# EAGLE design Finishline Display (EAGLE 7.7.0)
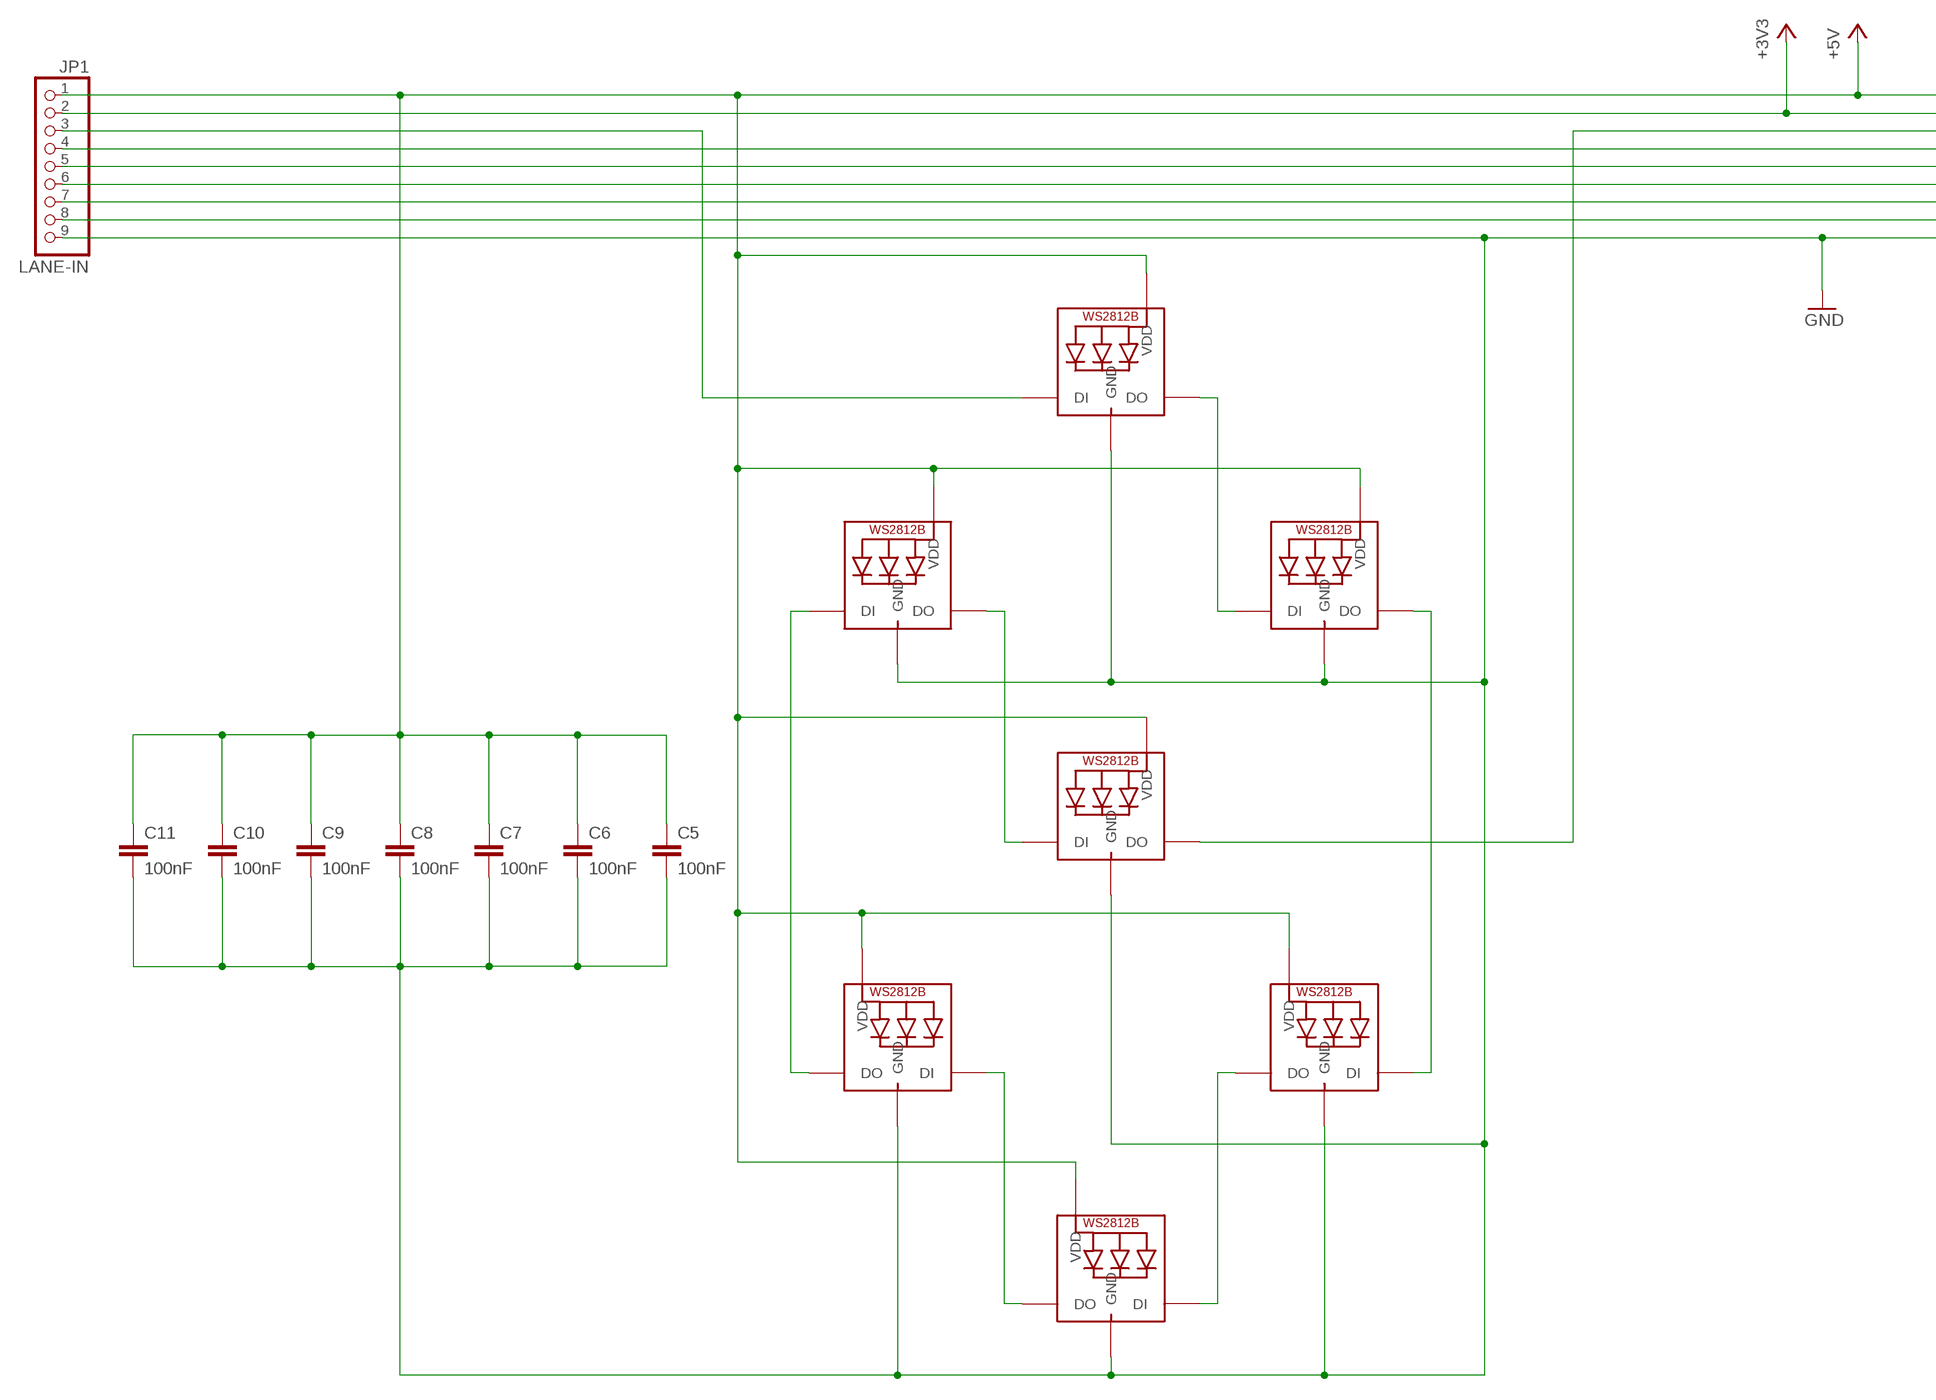
[diagram p0: schematic, sheet 1, part 1 of 2]
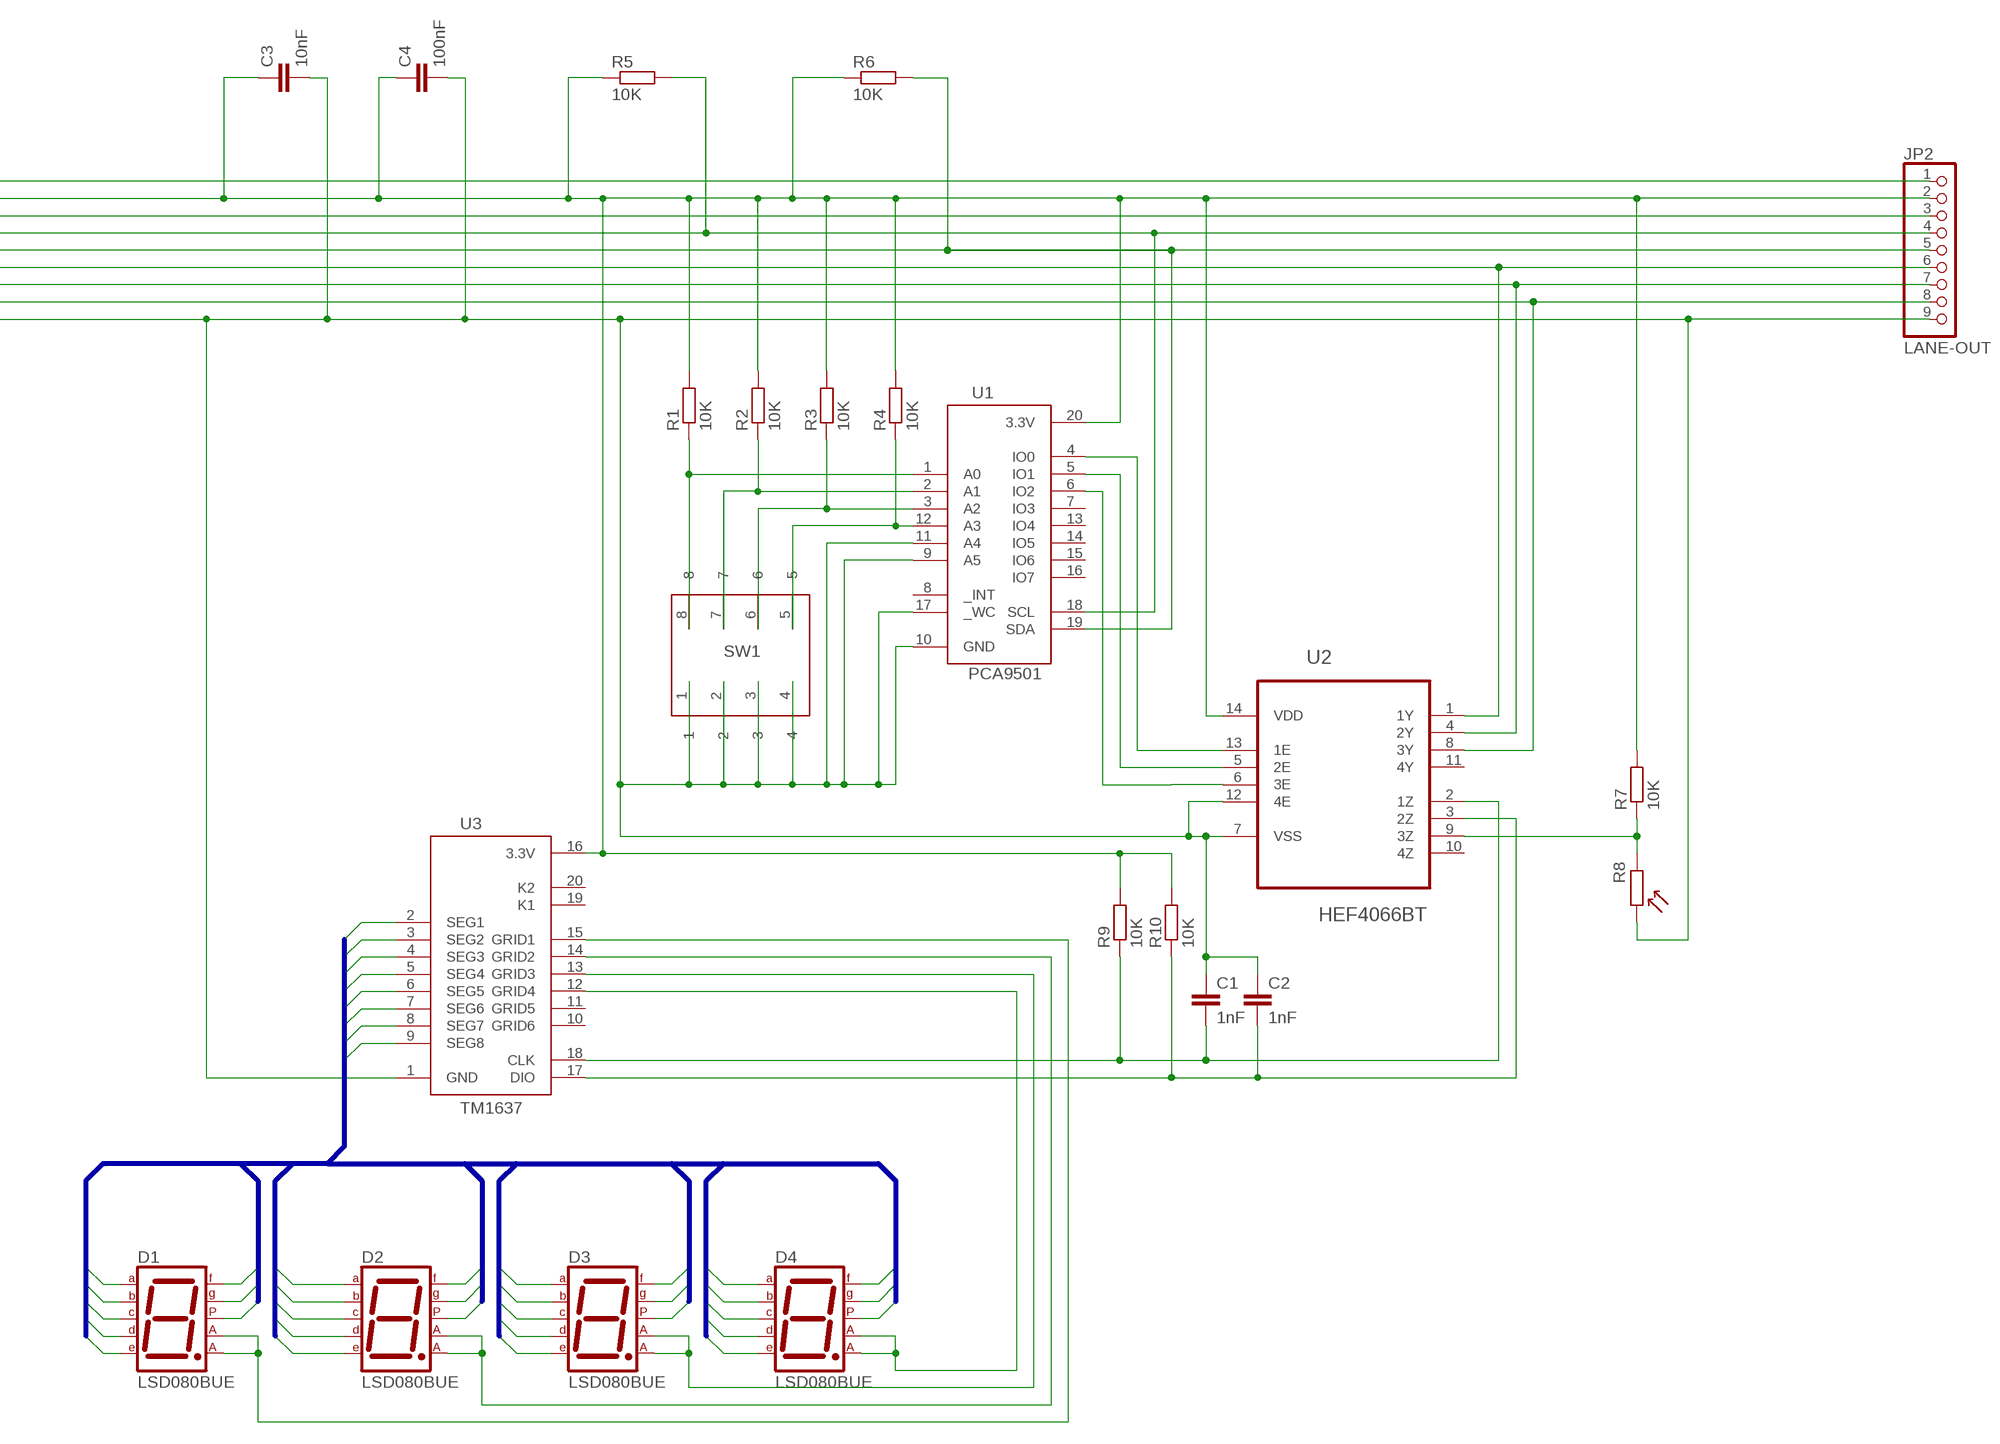
[diagram p1: schematic, sheet 1, part 2 of 2]

## Parts
C1  1nF  C-EUC0805  [C0805]
C2  1nF  C-EUC0805  [C0805]
C3  10nF  C-EUC0805  [C0805]
C4  100nF  C-EUC0805  [C0805]
C5  100nF  C-EUC0805  [C0805]
C6  100nF  C-EUC0805  [C0805]
C7  100nF  C-EUC0805  [C0805]
C8  100nF  C-EUC0805  [C0805]
C9  100nF  C-EUC0805  [C0805]
C10  100nF  C-EUC0805  [C0805]
C11  100nF  C-EUC0805  [C0805]
D1  LSD080BUE  7SEG-CA  [7SEG-13]
D2  LSD080BUE  7SEG-CA  [7SEG-13]
D3  LSD080BUE  7SEG-CA  [7SEG-13]
D4  LSD080BUE  7SEG-CA  [7SEG-13]
JP1  LANE-IN  PINHD-1X9  [1X09]
JP2  LANE-OUT  PINHD-1X9  [1X09]
LED1  WS2812B5050  [WS2812B]
LED2  WS2812B5050  [WS2812B]
LED3  WS2812B5050  [WS2812B]
LED4  WS2812B5050  [WS2812B]
LED5  WS2812B5050  [WS2812B]
LED6  WS2812B5050  [WS2812B]
LED7  WS2812B5050  [WS2812B]
R1  10K  R-EU_M0805  [M0805]
R2  10K  R-EU_M0805  [M0805]
R3  10K  R-EU_M0805  [M0805]
R4  10K  R-EU_M0805  [M0805]
R5  10K  R-EU_M0805  [M0805]
R6  10K  R-EU_M0805  [M0805]
R7  10K  R-EU_M0805  [M0805]
R8  LDR 10K  LDR-TH  [1X02]
R9  10K  R-EU_M0805  [M0805]
R10  10K  R-EU_M0805  [M0805]
SW1  416131160804  [416131160804]
U1  PCA9501  [SOIC127P1032X265-20N]
U2  HEF4066BT  [SOIC127P600X175-14N]
U3  TM1637  [SOIC127P1032X265-20N]

## Nets
+3V3: C3.1 C4.1 JP1.2 JP2.2 R1.2 R2.2 R3.2 R4.2 R5.1 R6.1 R7.2 R9.2 R10.2 U1.20(3.3V) U2.14(VDD) U3.16(3.3V)
+5V: C5.1 C6.1 C7.1 C8.1 C9.1 C10.1 C11.1 JP1.1 JP2.1 LED1.1-VDD(VDD) LED2.1-VDD(VDD) LED3.1-VDD(VDD) LED4.1-VDD(VDD) LED5.1-VDD(VDD) LED6.1-VDD(VDD) LED7.1-VDD(VDD)
CLK: JP1.6 JP2.6 U2.1(1Y)
DIO: JP1.7 JP2.7 U2.4(2Y)
GND: C1.1 C2.1 C3.2 C4.2 C5.2 C6.2 C7.2 C8.2 C9.2 C10.2 C11.2 JP1.9 JP2.9 LED1.3-GND(GND) LED2.3-GND(GND) LED3.3-GND(GND) LED4.3-GND(GND) LED5.3-GND(GND) LED6.3-GND(GND) LED7.3-GND(GND) R8.2 SW1.1 SW1.2 SW1.3 SW1.4 U1.9(A5) U1.10(GND) U1.11(A4) U1.17(_WC) U2.7(VSS) U2.12(4E) U3.1(GND)
LDR: JP1.8 JP2.8 U2.8(3Y)
N$1: U1.4(IO0) U2.13(1E)
N$2: LED1.2-DOUT(DO) LED2.4-DIN(DI)
N$3: LED2.2-DOUT(DO) LED3.4-DIN(DI)
N$4: LED3.2-DOUT(DO) LED4.4-DIN(DI)
N$5: LED4.2-DOUT(DO) LED5.4-DIN(DI)
N$6: LED5.2-DOUT(DO) LED6.4-DIN(DI)
N$7: LED6.2-DOUT(DO) LED7.4-DIN(DI)
N$8: JP2.3 LED7.2-DOUT(DO)
N$9: D1.3(CA1) D1.8(CA2) U3.15(GRID1)
N$10: D2.3(CA1) D2.8(CA2) U3.14(GRID2)
N$11: D3.3(CA1) D3.8(CA2) U3.13(GRID3)
N$12: D4.3(CA1) D4.8(CA2) U3.12(GRID4)
N$13: U1.5(IO1) U2.5(2E)
N$14: R1.1 SW1.8 U1.1(A0)
N$15: R2.1 SW1.7 U1.2(A1)
N$16: R3.1 SW1.6 U1.3(A2)
N$17: R4.1 SW1.5 U1.12(A3)
N$18: C1.2 R9.1 U2.2(1Z) U3.18(CLK)
N$19: C2.2 R10.1 U2.3(2Z) U3.17(DIO)
N$20: R7.1 R8.1 U2.9(3Z)
N$21: U1.6(IO2) U2.6(3E)
SCL: JP1.4 JP2.4 R5.2 U1.18(SCL)
SDA: JP1.5 JP2.5 R6.2 U1.19(SDA)
SEG1: D1.7(A) D2.7(A) D3.7(A) D4.7(A) U3.2(SEG1)
SEG2: D1.6(B) D2.6(B) D3.6(B) D4.6(B) U3.3(SEG2)
SEG3: D1.4(C) D2.4(C) D3.4(C) D4.4(C) U3.4(SEG3)
SEG4: D1.2(D) D2.2(D) D3.2(D) D4.2(D) U3.5(SEG4)
SEG5: D1.1(E) D2.1(E) D3.1(E) D4.1(E) U3.6(SEG5)
SEG6: D1.9(F) D2.9(F) D3.9(F) D4.9(F) U3.7(SEG6)
SEG7: D1.10(G) D2.10(G) D3.10(G) D4.10(G) U3.8(SEG7)
SEG8: D1.5(DP) D2.5(DP) D3.5(DP) D4.5(DP) U3.9(SEG8)
WS2812DATA: JP1.3 LED1.4-DIN(DI)
Unconnected: U1.7(IO3) U1.8(_INT) U1.13(IO4) U1.14(IO5) U1.15(IO6) U1.16(IO7) U2.10(4Z) U2.11(4Y) U3.10(GRID6) U3.11(GRID5) U3.19(K1) U3.20(K2)

## Buses
SEG[1..8]

## Library data of the parts
C1-C11 = rcl:C-EU: CAPACITOR, European symbol
D1-D4 = miro:7SEG-CA: 7-segment DISPLAY single anode, 13 mm
JP1 JP2 = pinhead:PINHD-1X9: PIN HEADER
LED1-LED7 = adafruit:WS2812B
R1-R7 R9 R10 = resistor:R-EU_: RESISTOR, European symbol
R8 = kanflo:LDR: Through hole light dependent resistor.
SW1 = Wurth_Elektronik_Electromechanic_Switchs_rev15b:416131160804: WS-HP-1.27 mm small compact SMD Dip Switch with top tape,8 pins,4 poles
U1 = miro:PCA9501: The PCA9501 is an 8-bit I/O expander with an on-board 2-kbit EEPROM and 6 address pins.
U2 = NXP_By_element14_Batch_1:HEF4066BT: Quad single-pole single-throw analog switch; MPN: HEF4066BT; OC_FARNELL: 1085287; OC_NEWARK: 97K1294; PACKAGE: SOIC-14; SUPPLIER: NXP
U3 = miro:TM1637

## Board
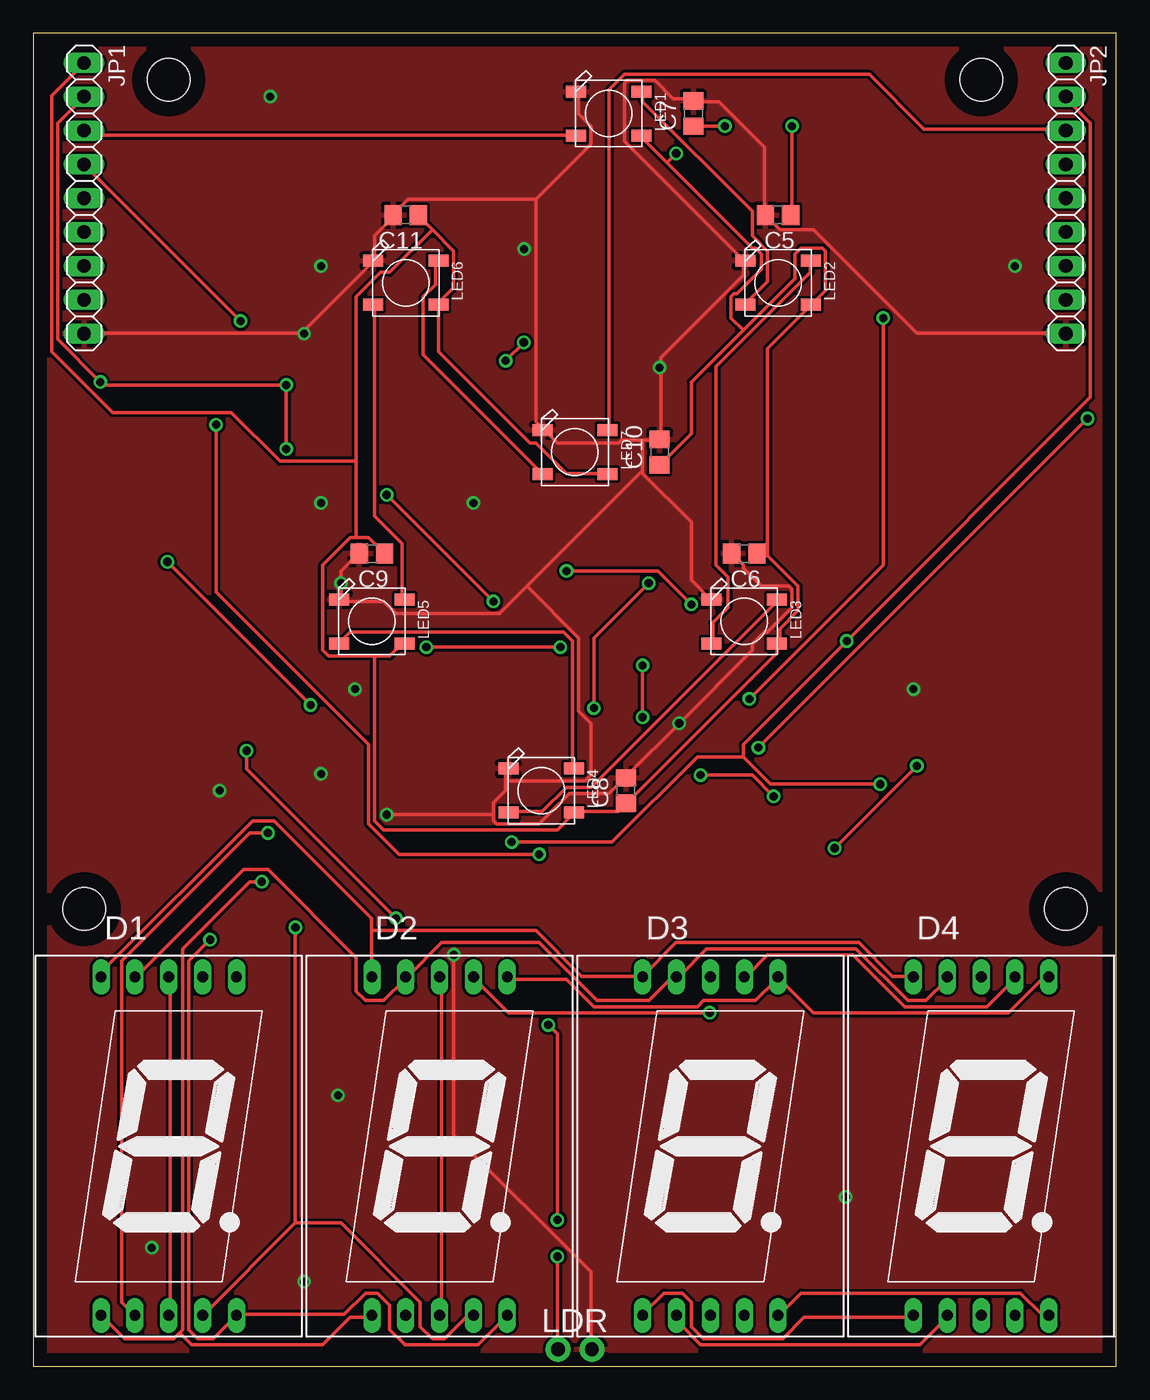
[diagram p2: board, top side]
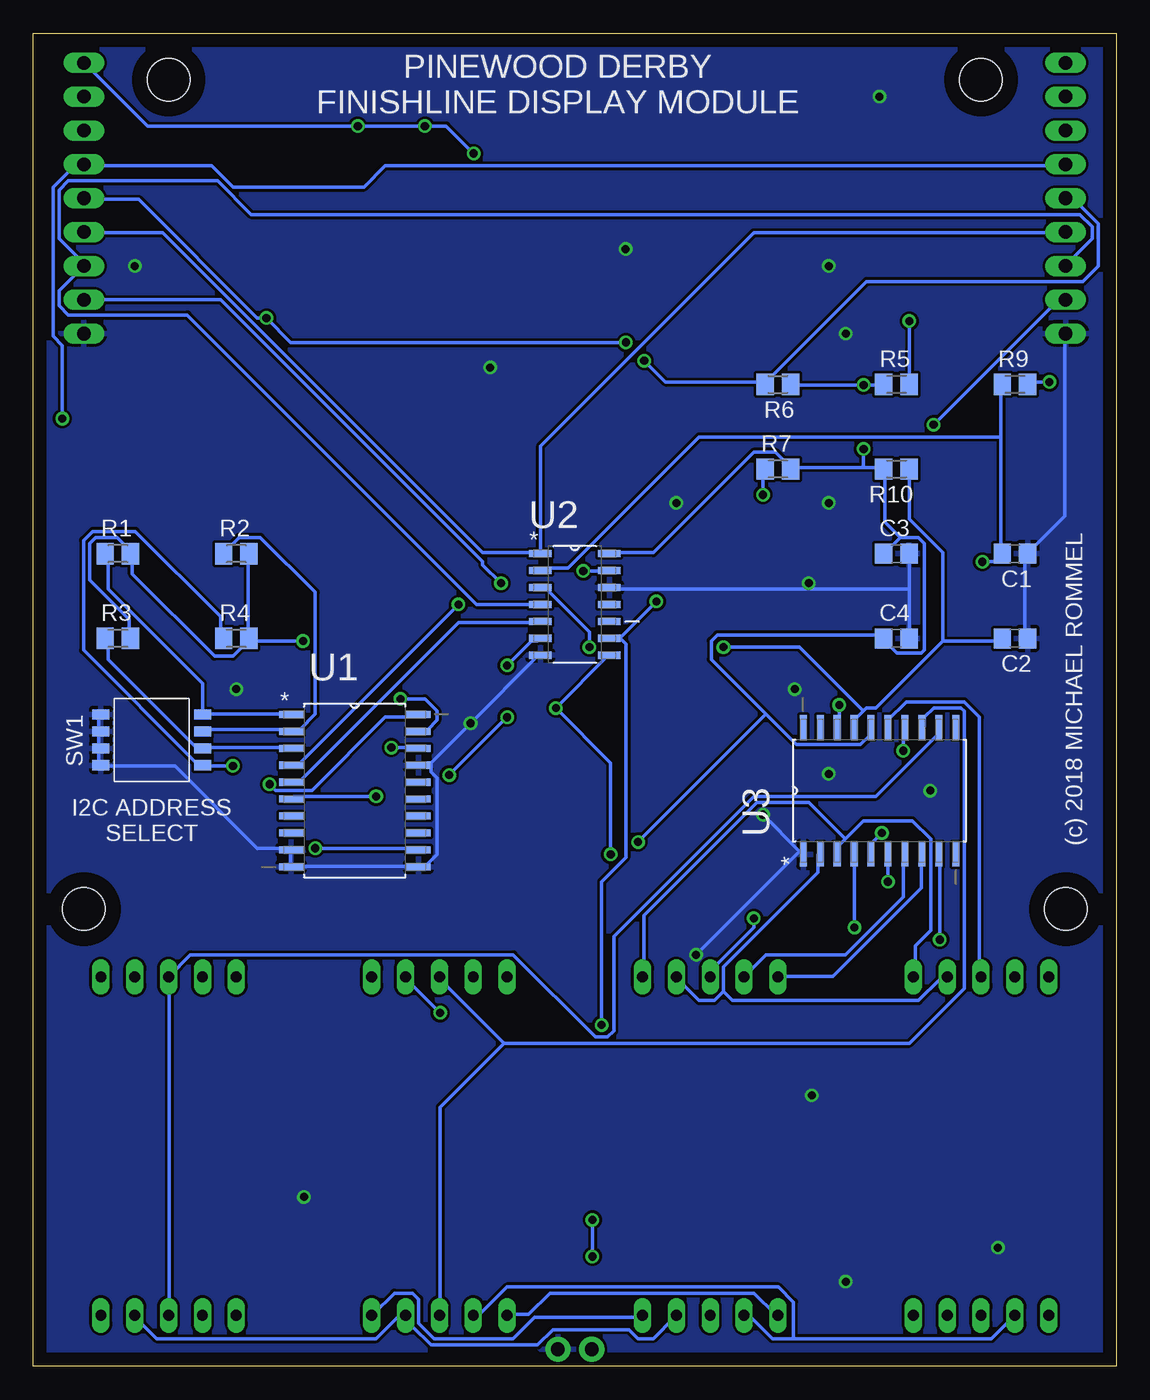
[diagram p3: board, bottom side, seen from below]

Size 81.27 x 100 mm. Coordinates in mm from the lower left corner, seen from the top.
Outline: 0,0 81.27,0 81.27,100 0,100 0,0
Copper layers (1*16): Top 0.035mm / dielectric 1.5mm / Bottom 0.035mm
Design rules "default": minimum track width 10mil, minimum drill 24mil, track to track 8mil, track to pad 8mil, pad to pad 8mil, via to via 8mil, smd to smd 8mil, copper to edge 40mil, drill to drill 8mil, minimum pad ring 10mil, minimum via ring 8mil, stop-mask expansion 4mil, vias tented up to drill 0mil, thermal gap 10mil
Holes 3.2 mm at 10.16,96.52 71.12,96.52 77.47,34.29 3.81,34.29
tRestrict: area 68.6,94 to 73.7,99.1; area 7.6,94 to 12.7,99.1; area 1.3,31.8 to 6.3,36.8; area 74.9,31.8 to 80,36.8
bRestrict: area 1.3,31.8 to 6.3,36.8; area 74.9,31.8 to 80,36.8; area 68.6,94 to 73.7,99.1; area 7.6,94 to 12.7,99.1

### Footprints (pad centres in the part's own frame; a part is rotated, then mirrored left to right if it is on the bottom)
C0805 = smd 1.3 x 1.5: 1 -0.95,0; 2 0.95,0
7SEG-13 = drill 0.813 long: 1 -5.08,-12.7; 2 -2.54,-12.7; 3 0,-12.7; 4 2.54,-12.7; 5 5.08,-12.7; 6 5.08,12.7; 7 2.54,12.7; 8 0,12.7; 9 -2.54,12.7; 10 -5.08,12.7
1X09 = drill 1.016 long: 1 -10.16,0; 2 -7.62,0; 3 -5.08,0; 4 -2.54,0; 5 0,0; 6 2.54,0; 7 5.08,0; 8 7.62,0; 9 10.16,0
WS2812B = smd 1.5 x 0.9: 1-VDD 2.45,-1.65; 2-DOUT 2.45,1.65; 3-GND -2.45,1.65; 4-DIN -2.45,-1.65
M0805 = smd 1.3 x 1.6: 1 -0.95,0; 2 0.95,0
1X02 = drill 1.016 pad 1.88: 1 -1.27,0; 2 1.27,0
416131160804 = smd 0.76 x 1.27: 1 0,-3.81; 2 1.27,-3.81; 3 2.54,-3.81; 4 3.81,-3.81; 5 3.81,3.81; 6 2.54,3.81; 7 1.27,3.81; 8 0,3.81
SOIC127P1032X265-20N = smd 1.803 x 0.533: 1 -4.775,5.715; 2 -4.775,4.445; 3 -4.775,3.175; 4 -4.775,1.905; 5 -4.775,0.635; 6 -4.775,-0.635; 7 -4.775,-1.905; 8 -4.775,-3.175; 9 -4.775,-4.445; 10 -4.775,-5.715; 11 4.775,-5.715; 12 4.775,-4.445; 13 4.775,-3.175; 14 4.775,-1.905; 15 4.775,-0.635; 16 4.775,0.635; 17 4.775,1.905; 18 4.775,3.175; 19 4.775,4.445; 20 4.775,5.715
SOIC127P600X175-14N = smd 1.702 x 0.533: 1 -2.591,3.81; 2 -2.591,2.54; 3 -2.591,1.27; 4 -2.591,0; 5 -2.591,-1.27; 6 -2.591,-2.54; 7 -2.591,-3.81; 8 2.591,-3.81; 9 2.591,-2.54; 10 2.591,-1.27; 11 2.591,0; 12 2.591,1.27; 13 2.591,2.54; 14 2.591,3.81

### Placement (x,y rotation side)
C1  7.62,60.96 180 bottom
C2  7.62,54.61 180 bottom
C3  16.51,60.96 0 bottom
C4  16.51,54.61 0 bottom
C5  55.88,86.36 180 top
C6  53.34,60.96 180 top
C7  49.53,93.98 90 top
C8  44.45,43.18 90 top
C9  25.4,60.96 180 top
C10  46.99,68.58 90 top
C11  27.94,86.36 180 top
D1  10.16,16.51 0 top
D2  30.48,16.51 0 top
D3  50.8,16.51 0 top
D4  71.12,16.51 0 top
JP1  3.81,87.63 270 top
JP2  77.47,87.63 270 top
LED1  43.18,93.98 0 top
LED2  55.88,81.28 0 top
LED3  53.34,55.88 0 top
LED4  38.1,43.18 0 top
LED5  25.4,55.88 0 top
LED6  27.94,81.28 0 top
LED7  40.64,68.58 0 top
R1  74.93,60.96 0 bottom
R2  66.04,60.96 0 bottom
R3  74.93,54.61 0 bottom
R4  66.04,54.61 0 bottom
R5  16.51,73.66 0 bottom
R6  25.4,73.66 180 bottom
R7  25.4,67.31 0 bottom
R8  40.64,1.27 0 top
R9  7.62,73.66 0 bottom
R10  16.51,67.31 180 bottom
SW1  72.39,48.9 270 bottom
U1  57.15,43.18 0 bottom
U2  40.64,57.15 0 bottom
U3  17.78,43.18 90 bottom

### Tracks (layer width: path | path; a pad name or v marks a point on that pad's centre or on a via)
+3V3  (via drill 0.61)
  Top 0.254: v63.55,43.66 55.32,43.66 53.26,45.72 | 53.26,45.72 53.26,46.63 v61.04,54.41 79.32,72.69 79.32,93.27 77.5,95.1 JP2.2 | JP1.2 1.83,93.27 1.83,77.04 v5.03,73.84 5.26,73.61 v18.97,73.61 v18.97,68.81 | 53.26,45.72 49.84,45.72 43.43,39.32 v35.89,39.32
  Bottom 0.254: R3.2 74.07,54.63 74.07,56.01 77.04,58.98 77.04,61.72 76.58,62.18 74.98,62.18 73.84,61.04 R1.2 73.84,60.81 73.84,59.44 67.67,53.26 66.29,53.26 65.15,54.41 R4.2 | R4.2 65.15,54.63 65.15,60.81 R2.2 | v63.55,43.66 63.09,43.2 60.35,43.2 54.86,48.69 52.58,48.69 U1.20 | v61.04,54.41 64.92,54.41 R4.2 | 16.23,62.18 14.86,62.18 14.4,61.72 14.4,53.72 14.63,53.49 16.46,53.49 17.37,54.41 C4.1 17.6,54.63 17.83,54.86 29.95,54.86 30.4,54.41 30.4,53.03 26.29,48.92 | 16.23,62.18 17.37,61.04 C3.1 | 16.23,62.18 17.37,63.32 17.37,67.21 R10.2 17.6,67.44 18.97,67.44 | 18.97,67.44 24.23,67.44 R7.2 24.46,67.44 25.6,68.58 27.2,68.58 34.75,61.04 37.95,61.04 U2.14 | 26.29,48.92 24,46.63 19.2,46.63 18.52,47.32 18.52,47.78 U3.16 | R5.1 17.6,73.61 v18.97,73.61 24.23,73.61 R6.1 | v5.03,73.84 6.63,73.84 R9.2 | v18.97,68.81 18.97,67.44 | 26.29,48.92 v35.89,39.32
+5V  (via drill 0.61)
  Top 0.254: 24.23,62.18 23.77,62.18 21.72,60.12 21.72,53.72 22.17,53.26 25.6,53.26 | 24.23,62.18 25.15,62.18 26.29,61.04 C9.1 | 25.6,53.26 26.75,53.26 27.66,54.18 LED5.1-VDD | LED7.1-VDD 42.98,66.98 40.01,66.98 37.72,69.27 37.26,69.27 30.4,76.12 30.4,79.55 LED6.1-VDD 30.4,79.78 31.55,80.92 31.55,83.67 29.95,85.27 | 29.95,85.27 29.03,86.18 C11.1 | 24.23,67.89 24.23,80.24 26.06,82.07 26.75,82.07 29.95,85.27 | 24.23,67.89 24.23,62.18 | 55.09,60.81 57.38,58.52 57.38,56.69 56.01,55.32 56.01,54.41 LED3.1-VDD 55.78,54.18 55.78,53.49 44.58,42.29 C8.1 44.35,42.06 43.89,41.6 40.69,41.6 LED4.1-VDD 40.46,41.38 39.32,40.23 26.29,40.23 25.6,40.92 25.6,53.26 | 55.09,60.81 54.41,60.81 C6.1 | 53.26,77.72 57.15,81.61 57.15,83.44 57.61,83.9 59.21,83.9 59.44,83.67 59.44,80.7 58.52,79.78 LED2.1-VDD 58.29,79.55 55.09,76.35 55.09,60.81 | 53.26,77.72 49.38,73.84 49.38,69.95 47.09,67.67 C10.1 | 47.55,90.3 53.95,83.9 54.18,83.9 54.63,83.44 54.63,82.3 52.81,80.47 52.58,80.47 52.35,80.24 52.35,78.64 53.26,77.72 | 47.55,90.3 45.72,92.13 LED1.1-VDD | v51.89,93.04 49.61,93.04 C7.1 | v56.92,93.04 56.92,86.41 C5.1 | 24.23,67.89 18.52,67.89 14.86,71.55 5.94,71.55 1.37,76.12 1.37,95.33 3.66,97.61 JP1.1 | 47.55,90.3 v48.23,90.98
  Bottom 0.254: JP2.1 77.27,97.61 72.69,93.04 v56.92,93.04 v51.89,93.04 50.29,93.04 v48.23,90.98
CLK
  Bottom 0.254: JP2.6 77.27,85.04 71.55,85.04 47.55,61.04 43.43,61.04 U2.1 43.2,61.04 43.2,69.04 27.2,85.04 3.89,85.04 JP1.6
DIO
  Bottom 0.254: U2.4 48.01,57.15 69.72,78.87 78.64,78.87 79.32,79.55 79.32,80.7 JP2.7 77.5,82.75 79.32,84.58 79.32,88.24 78.64,88.92 67.44,88.92 64.92,86.41 2.74,86.41 1.83,85.5 1.83,84.58 3.66,82.75 JP1.7
GND  (via drill 0.6, 0.61)
  Top 0.254: 35.43,43.89 35.43,43.2 34.52,42.29 34.52,41.38 | 35.43,43.89 35.43,44.81 LED4.3-GND | 34.52,41.38 34.52,40.92 34.75,40.69 37.95,40.69 40.23,42.98 43.2,42.98 44.35,44.12 C8.2 44.58,44.35 v48.46,48.23 53.95,53.72 53.95,54.18 54.86,55.09 55.09,55.09 56.92,56.92 56.92,58.29 56.69,58.52 54.63,58.52 53.26,59.89 53.26,60.12 52.58,60.81 C6.2 | 34.52,41.38 v26.52,41.38 | v31.55,30.86 31.55,17.37 41.83,7.09 41.83,1.37 R8.2 | 37.72,87.55 41.83,91.67 41.83,93.04 40.92,93.95 40.92,95.56 LED1.3-GND | 37.72,87.55 28.12,87.55 26.98,86.41 C11.2 26.98,86.18 25.6,84.81 25.6,82.98 LED6.3-GND 25.38,82.75 20.12,77.5 3.89,77.5 JP1.9 | JP2.9 77.27,77.5 66.29,77.5 58.52,85.27 56.01,85.27 55.09,86.18 C5.2 54.86,86.41 54.86,91.44 51.44,94.87 49.61,94.87 C7.2 49.38,95.1 48.01,95.1 46.63,96.47 44.58,96.47 44.35,96.24 44.35,91.9 53.26,82.98 LED2.3-GND 53.26,82.75 53.26,81.84 47.09,75.67 47.09,69.72 C10.2 46.86,69.49 45.72,69.49 | C9.2 24.23,60.81 23.09,59.66 v23.09,58.75 23.09,57.61 LED5.3-GND 23.09,57.38 26.29,57.38 27.2,56.46 34.98,56.46 37.03,58.52 | 45.72,69.49 44.12,69.49 43.89,69.27 39.32,69.27 38.41,70.18 LED7.3-GND 38.18,70.41 37.72,70.87 37.72,87.55 | 45.72,69.49 45.72,67.21 | 45.72,67.21 45.72,66.98 49.38,63.32 49.38,58.98 50.75,57.61 LED3.3-GND | 45.72,67.21 37.03,58.52 | 35.43,43.89 41.38,43.89 41.83,44.35 41.83,48.23 40.92,49.15 40.92,54.63 37.03,58.52
  Bottom 0.254: 51.44,45.26 v48.46,48.23 43.43,53.26 U2.7 | 51.44,45.26 52.35,45.26 U1.17 | SW1.1 76.35,48.69 76.35,47.78 SW1.2 76.35,47.55 76.35,46.41 SW1.3 76.35,46.18 76.35,45.26 SW1.4 76.12,45.03 70.64,45.03 64.47,38.86 61.95,38.86 U1.9 61.95,38.63 61.95,37.49 U1.10 61.72,37.49 52.58,37.49 U1.11 52.35,37.49 51.89,37.49 50.98,38.41 50.98,44.12 51.44,44.58 51.44,45.26 | v26.52,41.38 23.77,38.63 | 23.77,38.63 23.55,38.41 U3.1 | 23.77,38.63 v31.55,30.86 | C2.1 6.86,54.63 6.86,60.81 C1.1 6.63,61.04 3.89,63.78 3.89,77.27 JP1.9 | 15.54,58.29 15.54,60.81 C3.2 | 15.54,58.29 15.54,54.63 C4.2 | 15.54,58.29 23.09,58.29 | 23.09,58.29 37.95,58.29 U2.12 | 23.09,58.29 v23.09,58.75
  other vias: 21.59,64.77 22.86,20.32 20.32,6.35 8.89,8.89 36.83,83.82 17.78,95.25 46.99,74.93 21.59,82.55 20.32,77.47 21.59,44.45 13.97,43.18 24.13,50.8 66.04,50.8 73.66,82.55 33.02,64.77 60.96,12.7
  pour Bottom: -1.27,101.6 82.55,101.6 82.55,-1.27 -1.27,-1.27
  pour Top: -1.27,101.6 82.55,101.6 82.55,-1.27 -1.27,-1.27
LDR  (via drill 0.61)
  Top 0.254: v42.06,49.38 42.06,54.63 v46.18,58.75 | v13.72,70.64 13.72,58.06 25.15,46.63 25.15,40.69 27.43,38.41 v37.95,38.41
  Bottom 0.254: v46.18,58.75 47.55,60.12 47.55,60.35 67.21,80.01 JP2.8 | U2.8 38.18,53.26 v42.06,49.38 37.95,45.26 v37.95,38.41 | JP1.8 4.34,80.01 v13.72,70.64
N$1  (via drill 0.61)
  Top 0.254: v40.01,59.66 46.86,59.66 v49.38,57.15
  Bottom 0.254: v40.01,59.66 38.18,59.66 U2.13 | v49.38,57.15 61.27,45.26 61.72,45.26 U1.4
N$2
  Top 0.254: LED1.2-DOUT 45.72,95.56 45.72,94.87 53.95,86.64 53.95,84.81 55.09,83.67 55.09,81.38 53.49,79.78 LED2.4-DIN
N$3
  Top 0.254: LED3.4-DIN 50.98,54.41 50.98,55.78 52.12,56.92 52.12,59.21 51.21,60.12 51.21,74.98 58.29,82.07 58.29,82.75 LED2.2-DOUT
N$4
  Top 0.254: LED4.4-DIN 35.66,41.6 38.18,41.6 40.01,43.43 41.83,43.43 55.78,57.38 LED3.2-DOUT
N$5
  Top 0.254: LED4.2-DOUT 40.46,45.03 40.46,54.41 39.78,55.09 23.77,55.09 23.09,54.41 LED5.4-DIN
N$6
  Top 0.254: LED6.4-DIN 25.6,79.55 25.6,63.78 27.66,61.72 27.66,57.61 LED5.2-DOUT
N$7
  Top 0.254: LED6.2-DOUT 30.18,82.75 30.18,81.15 29.26,80.24 29.26,75.89 38.18,66.98 LED7.4-DIN
N$8
  Top 0.254: LED7.2-DOUT 43.2,70.41 43.2,95.78 44.35,96.93 62.71,96.93 66.83,92.81 77.27,92.81 JP2.3
N$9
  Top 0.254: D1.3 10.29,3.89 10.29,29.03 D1.8
  Bottom 0.254: U3.15 17.14,48.46 15.77,49.84 11.43,49.84 10.29,48.69 10.29,29.26 D1.8
N$10  (via drill 0.61)
  Top 0.254: v16,46.18 16,44.81 v27.2,33.6 | D2.3 30.63,3.89 30.63,29.03 D2.8
  Bottom 0.254: v16,46.18 16,47.78 U3.14 | v27.2,33.6 27.2,32.92 30.4,29.72 30.4,29.26 D2.8
N$11
  Bottom 0.254: 45.95,24.23 15.54,24.23 11.43,28.35 11.43,49.15 11.66,49.38 13.72,49.38 14.4,48.69 14.4,48.01 U3.13 | 45.95,24.23 50.75,29.03 D3.8 | 45.95,24.23 50.75,19.43 50.75,3.89 D3.3
N$12
  Bottom 0.254: U3.12 13.49,47.78 13.49,47.32 18.06,42.75 27.2,42.75 37.72,32.23 37.72,25.15 38.18,24.69 39.09,24.69 45.26,30.86 69.49,30.86 71.09,29.26 D4.8 71.09,29.03 71.09,3.89 D4.3
N$13
  Bottom 0.254: U2.5 43.43,55.78 49.38,55.78 61.27,43.89 61.72,43.89 U1.5
N$14
  Bottom 0.254: 68.58,48.92 61.95,48.92 U1.1 | 68.58,48.92 68.58,51.21 75.67,58.29 75.67,60.81 R1.1 | 68.58,48.92 SW1.8
N$15
  Bottom 0.254: SW1.7 68.58,47.78 61.95,47.78 U1.2 61.72,47.78 61.27,47.78 60.12,48.92 60.12,58.06 64.24,62.18 65.84,62.18 66.98,61.04 R2.1
N$16
  Bottom 0.254: 68.58,46.41 61.95,46.41 U1.3 | 68.58,46.41 69.04,46.41 75.67,53.03 75.67,54.41 R3.1 | 68.58,46.41 SW1.6
N$17  (via drill 0.61)
  Top 0.254: v66.29,45.03 v60.12,38.86
  Bottom 0.254: R4.1 67.21,54.63 67.21,56.24 73.61,62.64 76.81,62.64 77.5,61.95 77.5,53.72 69.04,45.26 68.58,45.26 SW1.5 68.58,45.03 v66.29,45.03 | v60.12,38.86 52.58,38.86 U1.12
N$18  (via drill 0.61)
  Top 0.254: v10.06,60.35 v20.8,49.61
  Bottom 0.254: 8.69,69.72 8.69,73.61 R9.1 | 8.69,69.72 8.69,61.04 C1.2 8.69,60.81 9.14,60.35 v10.06,60.35 | 8.69,69.72 31.32,69.72 41.15,59.89 43.2,59.89 U2.2 | v20.8,49.61 20.8,48.01 U3.18
N$19  (via drill 0.61)
  Top 0.254: v29.49,53.95 v39.55,53.95
  Bottom 0.254: 13.03,54.41 8.69,54.41 C2.2 | 13.03,54.41 18.06,49.38 18.75,49.38 18.97,49.15 | 18.97,49.15 19.66,48.46 19.66,48.01 U3.17 | 13.03,54.41 13.03,61.04 15.54,63.55 15.54,67.21 R10.1 | v39.55,53.95 39.55,55.09 42.75,58.29 43.2,58.29 U2.3 | v29.49,53.95 23.77,53.95 18.97,49.15
N$20  (via drill 0.61)
  Top 0.254: v34.52,57.38 v26.52,65.38 | v39.32,8.23 39.32,1.37 R8.1 | v39.32,10.97 39.32,24.92 v38.63,25.6
  Bottom 0.254: v26.52,65.38 26.52,67.21 R7.1 | 37.26,54.63 v34.52,57.38 | 37.26,54.63 37.95,54.63 U2.9 37.26,54.63 | v39.32,10.97 v39.32,8.23 | v38.63,25.6 38.63,36.35 36.8,38.18 36.8,54.18 37.26,54.63
N$21  (via drill 0.61)
  Top 0.254: v45.72,48.69 v45.72,52.58 | v50.06,44.35 53.95,44.35 v55.55,42.75
  Bottom 0.254: v45.72,52.58 43.89,54.41 43.43,54.41 U2.6 | v50.06,44.35 v45.72,48.69 | v55.55,42.75 61.72,42.75 U1.6
SCL  (via drill 0.61)
  Top 0.254: v15.54,78.41 3.89,90.07 JP1.4 | v79.1,71.09 v54.41,46.41
  Bottom 0.254: v15.54,78.41 15.54,73.84 R5.2 | v54.41,46.41 52.58,46.41 U1.18 | v79.1,71.09 79.1,76.58 79.78,77.27 79.78,88.47 78.18,90.07 77.5,90.07 JP2.4 77.27,90.07 67.89,90.07 66.29,88.47 56.46,88.47 54.86,90.07 3.89,90.07 JP1.4
SDA  (via drill 0.61)
  Top 0.254: v53.72,50.06 63.78,60.12 v63.78,78.64 | v36.8,76.81 v35.43,75.44
  Bottom 0.254: JP1.5 3.66,87.55 3.2,87.55 1.37,85.72 1.37,82.53 2.52,81.38 18.75,81.38 26.29,73.84 R6.2 26.52,73.84 33.83,73.84 v35.43,75.44 | v53.72,50.06 51.89,50.06 50.98,49.15 50.98,48.46 51.66,47.78 52.35,47.78 U1.19 | JP2.5 77.27,87.55 73.38,87.55 64.47,78.64 v63.78,78.64 61.95,76.81 v36.8,76.81
SEG1  (via drill 0.61)
  Top 0.254: D3.7 53.49,29.26 55.09,30.86 61.49,30.86 65.38,26.98 71.55,26.98 73.61,29.03 D4.7 | v50.75,26.52 35.66,26.52 33.15,29.03 D2.7
  Bottom 0.254: 29.49,28.12 29.49,29.95 22.4,37.03 22.4,38.41 U3.2 | 29.49,28.12 30.18,27.43 31.32,27.43 32.92,29.03 D2.7 | 29.49,28.12 28.8,27.43 14.86,27.43 13.26,29.03 12.8,29.03 D1.7 | v50.75,26.52 53.26,29.03 D3.7
SEG2
  Top 0.254: D2.6 35.66,29.03 40.01,29.03 42.06,26.98 49.84,26.98 50.29,27.43 54.18,27.43 55.78,29.03 D3.6 56.01,29.03 58.52,26.52 73.15,26.52 75.67,29.03 76.12,29.03 D4.6
  Bottom 0.254: 20.34,39.55 18.97,40.92 15.32,40.92 13.95,39.55 13.95,32.69 15.09,31.55 15.09,29.26 D1.6 | 20.34,39.55 20.8,39.09 20.8,38.41 U3.3 | 20.34,39.55 23.09,42.29 26.98,42.29 35.43,33.83 35.43,29.26 D2.6
SEG3  (via drill 0.61)
  Top 0.254: 19.66,10.74 v19.66,32.92 | 19.66,10.74 12.8,3.89 D1.4 | 19.66,10.74 23.09,10.74 29.03,4.8 29.03,2.97 29.95,2.06 30.86,2.06 32.46,3.66 32.92,3.66 D2.4
  Bottom 0.254: D4.4 73.61,3.66 72.01,2.06 55.55,2.06 53.95,3.66 53.49,3.66 D3.4 53.26,3.66 52.81,3.2 52.81,2.97 51.44,1.6 43.43,1.6 42.29,2.74 36.58,2.74 35.89,2.06 34.75,2.06 33.15,3.66 D2.4 | v19.66,32.92 19.66,38.41 U3.4
SEG4  (via drill 0.61)
  Top 0.254: D3.2 48.46,3.66 48.46,3.2 50.06,1.6 66.52,1.6 68.58,3.66 D4.2 | v17.6,40.01 16.23,40.01 6.63,30.4 6.63,4.8 D1.2
  Bottom 0.254: v17.6,40.01 18.29,39.32 18.29,38.41 U3.5 | 24.23,2.06 9.37,2.06 D1.2 | 24.23,2.06 25.83,2.06 27.43,3.66 27.89,3.66 D2.2 | 24.23,2.06 24.23,4.8 25.38,5.94 45.72,5.94 47.78,3.89 48.23,3.89 D3.2
SEG5  (via drill 0.61)
  Top 0.254: v17.14,36.35 16.23,36.35 11.2,31.32 11.2,2.74 10.97,2.52 | 10.97,2.52 10.52,2.06 6.86,2.06 5.26,3.66 D1.1 | 10.97,2.52 11.89,1.6 21.72,1.6 23.77,3.66 25.38,3.66 D2.1 | D4.1 65.84,3.66 57.84,3.66 56.24,2.06 50.29,2.06 49.38,2.97 49.38,4.8 48.69,5.49 47.32,5.49 45.72,3.89 D3.1
  Bottom 0.254: v17.14,36.35 U3.6 | D3.1 45.72,3.89 44.12,3.89 42.52,5.49 27.2,5.49 25.6,3.89 D2.1
SEG6
  Top 0.254: D4.9 68.58,29.03 66.98,27.43 65.61,27.43 61.72,31.32 50.52,31.32 48.46,29.26 D3.9 48.23,29.03 47.78,29.03 46.18,27.43 42.29,27.43 37.95,31.77 30.63,31.77 28.12,29.26 D2.9 27.89,29.03 26.29,27.43 24.92,27.43 24.23,28.12 24.23,30.63 17.6,37.26 15.77,37.26 7.77,29.26 D1.9
  Bottom 0.254: D2.9 26.29,30.86 20.34,30.86 16,35.2 16,38.41 U3.7
SEG7
  Top 0.254: 25.38,32.69 25.38,29.26 D2.10 | 25.38,32.69 25.38,33.6 18.06,40.92 16.46,40.92 5.26,29.72 5.26,29.26 D1.10 | 45.72,29.26 41.15,29.26 37.72,32.69 25.38,32.69 | 45.72,29.26 48.23,31.77 61.95,31.77 64.47,29.26 65.84,29.26 D4.10 | 45.72,29.26 D3.10
  Bottom 0.254: U3.8 14.63,38.41 14.63,35.89 21.26,29.26 25.38,29.26 D2.10
SEG8  (via drill 0.61)
  Top 0.254: v13.26,32 11.66,30.4 11.66,2.74 12.34,2.06 13.49,2.06 D1.5 15.32,3.89 23.32,3.89 24.92,5.49 25.83,5.49 26.75,4.57 26.75,2.74 27.89,1.6 33.38,1.6 35.43,3.66 D2.5 | D4.5 76.12,3.89 75.67,3.89 74.07,5.49 57.61,5.49 56.01,3.89 D3.5
  Bottom 0.254: v13.26,32 13.26,38.41 U3.9 | D2.5 35.66,3.66 43.66,3.66 45.26,2.06 51.21,2.06 52.35,3.2 52.35,5.03 52.81,5.49 54.18,5.49 55.78,3.89 D3.5
WS2812DATA
  Top 0.254: LED1.4-DIN 40.69,92.35 4.12,92.35 3.89,92.58 JP1.3

### Text on the board
tNames: LDR
bNames: PINEWOOD DERBY / FINISHLINE DISPLAY MODULE | (c) 2018 MICHAEL ROMMEL | I2C ADDRESS / SELECT